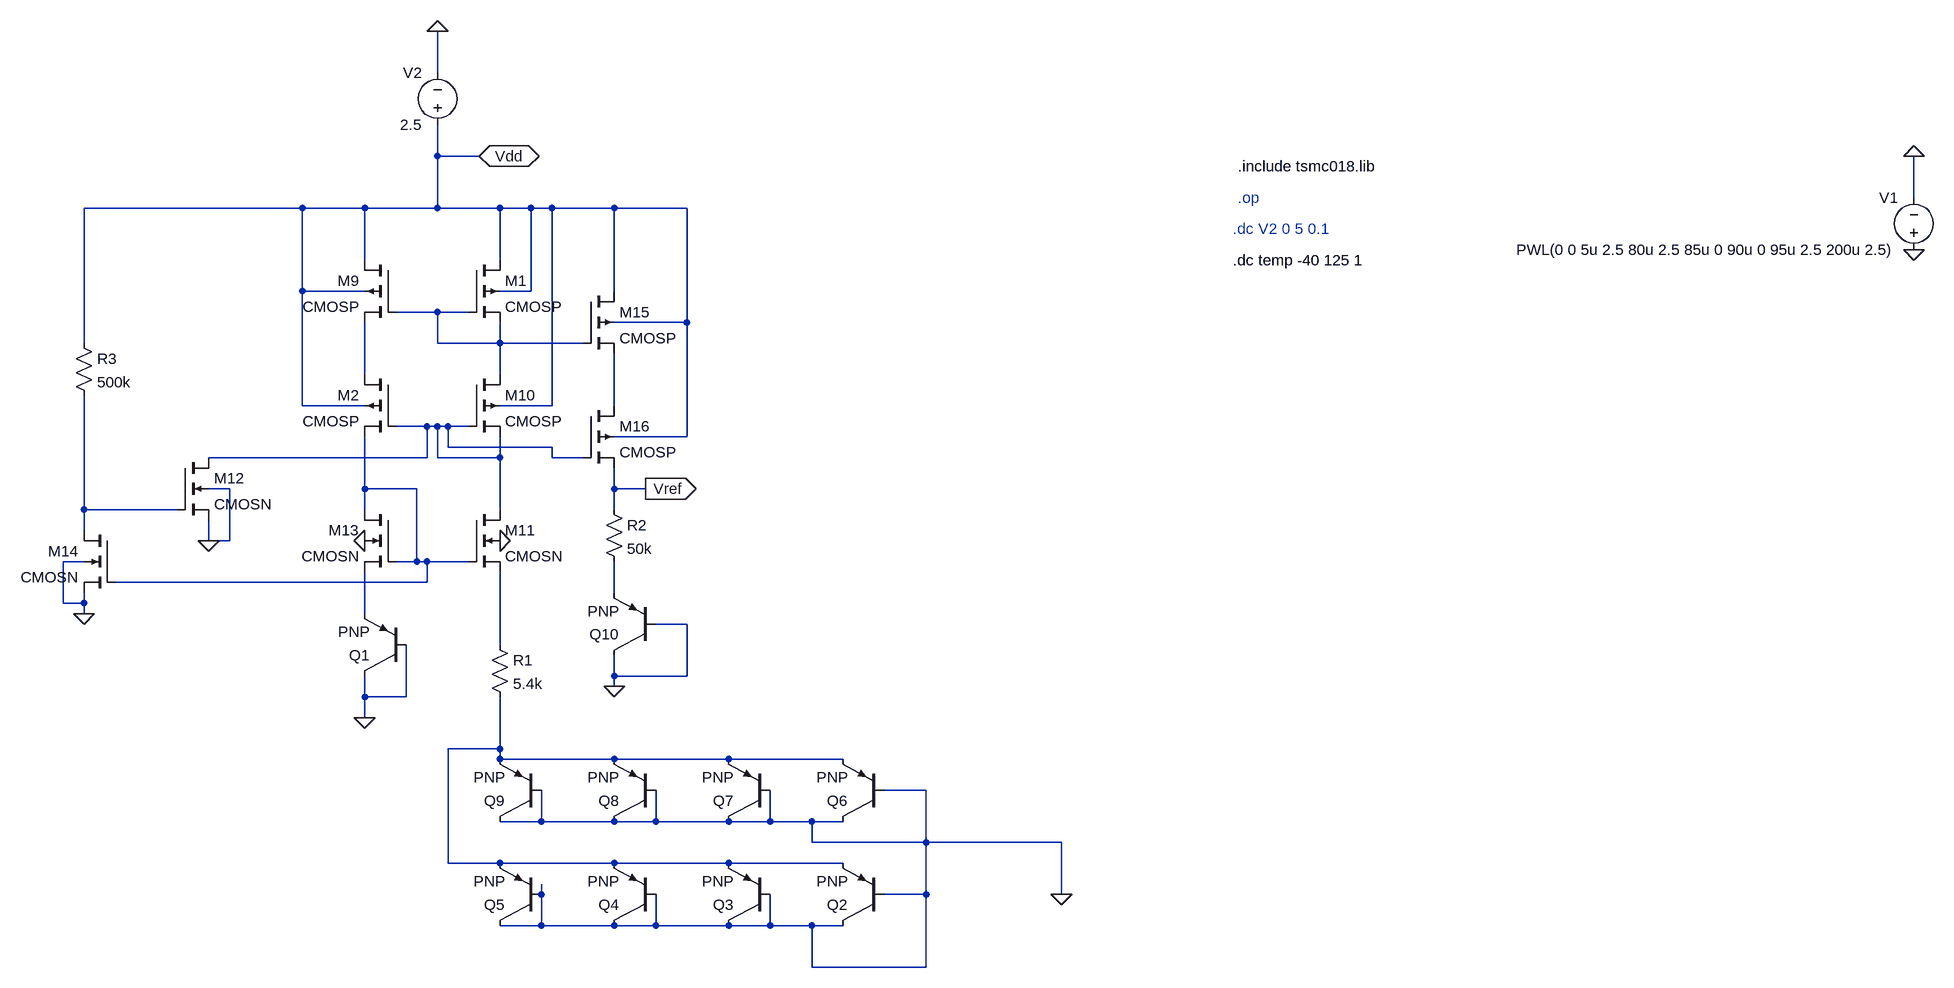
[diagram p0: schematic bgr_start_up.asc]
bgr_start_up.asc, the LTspice schematic file:
Version 4.1
SHEET 1 2292 692
WIRE -224 -2016 -224 -2080
WIRE -224 -1888 -224 -1936
WIRE -160 -1888 -224 -1888
WIRE 2048 -1824 2048 -1888
WIRE -432 -1808 -768 -1808
WIRE -336 -1808 -432 -1808
WIRE -224 -1808 -224 -1888
WIRE -224 -1808 -336 -1808
WIRE -128 -1808 -224 -1808
WIRE -80 -1808 -128 -1808
WIRE -48 -1808 -80 -1808
WIRE 48 -1808 -48 -1808
WIRE 160 -1808 48 -1808
WIRE -336 -1728 -336 -1808
WIRE -128 -1728 -128 -1808
WIRE -432 -1680 -432 -1808
WIRE -336 -1680 -432 -1680
WIRE -80 -1680 -80 -1808
WIRE -80 -1680 -128 -1680
WIRE 48 -1680 48 -1808
WIRE -224 -1648 -288 -1648
WIRE -176 -1648 -224 -1648
WIRE 160 -1632 160 -1808
WIRE 160 -1632 48 -1632
WIRE -768 -1600 -768 -1808
WIRE -224 -1600 -224 -1648
WIRE -128 -1600 -128 -1632
WIRE -128 -1600 -224 -1600
WIRE 0 -1600 -128 -1600
WIRE -336 -1552 -336 -1632
WIRE -128 -1552 -128 -1600
WIRE -432 -1504 -432 -1680
WIRE -336 -1504 -432 -1504
WIRE -48 -1504 -48 -1808
WIRE -48 -1504 -128 -1504
WIRE 48 -1504 48 -1584
WIRE -240 -1472 -288 -1472
WIRE -224 -1472 -240 -1472
WIRE -208 -1472 -224 -1472
WIRE -176 -1472 -208 -1472
WIRE 160 -1456 160 -1632
WIRE 160 -1456 48 -1456
WIRE -208 -1440 -208 -1472
WIRE -48 -1440 -208 -1440
WIRE -240 -1424 -240 -1472
WIRE -240 -1424 -576 -1424
WIRE -224 -1424 -224 -1472
WIRE -128 -1424 -128 -1456
WIRE -128 -1424 -224 -1424
WIRE -48 -1424 -48 -1440
WIRE 0 -1424 -48 -1424
WIRE -544 -1376 -576 -1376
WIRE -336 -1376 -336 -1456
WIRE -256 -1376 -336 -1376
WIRE 48 -1376 48 -1408
WIRE 96 -1376 48 -1376
WIRE -768 -1344 -768 -1520
WIRE -624 -1344 -768 -1344
WIRE -336 -1344 -336 -1376
WIRE -128 -1344 -128 -1424
WIRE 48 -1344 48 -1376
WIRE -768 -1312 -768 -1344
WIRE -576 -1296 -576 -1328
WIRE -544 -1296 -544 -1376
WIRE -544 -1296 -576 -1296
WIRE -768 -1264 -800 -1264
WIRE -256 -1264 -256 -1376
WIRE -256 -1264 -288 -1264
WIRE -240 -1264 -256 -1264
WIRE -176 -1264 -240 -1264
WIRE -240 -1232 -240 -1264
WIRE -240 -1232 -720 -1232
WIRE 48 -1216 48 -1264
WIRE -800 -1200 -800 -1264
WIRE -768 -1200 -768 -1216
WIRE -768 -1200 -800 -1200
WIRE -768 -1184 -768 -1200
WIRE -336 -1184 -336 -1248
WIRE 160 -1168 112 -1168
WIRE -128 -1136 -128 -1248
WIRE 48 -1088 48 -1120
WIRE 160 -1088 160 -1168
WIRE 160 -1088 48 -1088
WIRE 48 -1072 48 -1088
WIRE -336 -1056 -336 -1088
WIRE -272 -1056 -272 -1136
WIRE -272 -1056 -336 -1056
WIRE -336 -1024 -336 -1056
WIRE -128 -976 -128 -1056
WIRE -128 -976 -208 -976
WIRE -128 -960 -128 -976
WIRE 48 -960 -128 -960
WIRE 224 -960 48 -960
WIRE 400 -960 224 -960
WIRE 528 -912 464 -912
WIRE -64 -864 -64 -912
WIRE -64 -864 -128 -864
WIRE 48 -864 -64 -864
WIRE 112 -864 112 -912
WIRE 112 -864 48 -864
WIRE 224 -864 112 -864
WIRE 288 -864 288 -912
WIRE 288 -864 224 -864
WIRE 352 -864 288 -864
WIRE 400 -864 352 -864
WIRE 352 -832 352 -864
WIRE 528 -832 528 -912
WIRE 528 -832 352 -832
WIRE 736 -832 528 -832
WIRE -208 -800 -208 -976
WIRE -128 -800 -208 -800
WIRE 48 -800 -128 -800
WIRE 224 -800 48 -800
WIRE 400 -800 224 -800
WIRE -64 -752 -64 -768
WIRE 528 -752 528 -832
WIRE 528 -752 464 -752
WIRE 736 -752 736 -832
WIRE -64 -704 -64 -752
WIRE -64 -704 -128 -704
WIRE 48 -704 -64 -704
WIRE 112 -704 112 -752
WIRE 112 -704 48 -704
WIRE 224 -704 112 -704
WIRE 288 -704 288 -752
WIRE 288 -704 224 -704
WIRE 352 -704 288 -704
WIRE 400 -704 352 -704
WIRE 352 -640 352 -704
WIRE 528 -640 528 -752
WIRE 528 -640 352 -640
FLAG 736 -752 0
FLAG -336 -1024 0
FLAG -336 -1296 0
FLAG -128 -1296 0
FLAG 2048 -1888 0
FLAG 48 -1072 0
FLAG 96 -1376 Vref
IOPIN 96 -1376 Out
FLAG -576 -1296 0
FLAG 2048 -1744 0
FLAG -224 -2080 0
FLAG -768 -1184 0
FLAG -160 -1888 Vdd
IOPIN -160 -1888 BiDir
SYMBOL pnp -272 -1088 R180
SYMATTR InstName Q1
SYMBOL pnp 464 -704 R180
SYMATTR InstName Q2
SYMBOL pnp 288 -704 R180
SYMATTR InstName Q3
SYMBOL pnp 112 -704 R180
SYMATTR InstName Q4
SYMBOL pnp -64 -704 R180
SYMATTR InstName Q5
SYMBOL pnp 464 -864 R180
SYMATTR InstName Q6
SYMBOL pnp 288 -864 R180
SYMATTR InstName Q7
SYMBOL pnp 112 -864 R180
SYMATTR InstName Q8
SYMBOL pnp -64 -864 R180
SYMATTR InstName Q9
SYMBOL res -144 -1152 R0
SYMATTR InstName R1
SYMATTR Value 5.4k
SYMBOL voltage 2048 -1728 R180
WINDOW 0 24 96 Left 2
WINDOW 3 24 16 Left 2
WINDOW 123 0 0 Left 0
WINDOW 39 0 0 Left 0
SYMATTR InstName V1
SYMATTR Value PWL(0 0 5u 2.5 80u 2.5 85u 0 90u 0 95u 2.5 200u 2.5)
SYMBOL res 32 -1360 R0
SYMATTR InstName R2
SYMATTR Value 50k
SYMBOL pnp 112 -1120 R180
SYMATTR InstName Q10
SYMBOL res -784 -1616 R0
SYMATTR InstName R3
SYMATTR Value 500k
SYMBOL voltage -224 -1920 R180
WINDOW 0 24 96 Left 2
WINDOW 3 24 16 Left 2
WINDOW 123 0 0 Left 0
WINDOW 39 0 0 Left 0
SYMATTR InstName V2
SYMATTR Value 2.5
SYMBOL cmosn -176 -1344 R0
SYMATTR InstName M11
SYMATTR Value2 l=4u w=20u
SYMBOL cmosn -624 -1424 R0
SYMATTR InstName M12
SYMATTR Value2 l=1u w=20u
SYMBOL cmosn -288 -1344 M0
SYMATTR InstName M13
SYMATTR Value2 l=4u w=20u
SYMBOL cmosn -720 -1312 M0
SYMATTR InstName M14
SYMATTR Value2 l=1u w=20u
SYMBOL cmosp -176 -1728 R0
SYMATTR InstName M1
SYMATTR Value2 l=1u w=80u
SYMBOL cmosp -288 -1552 M0
SYMATTR InstName M2
SYMATTR Value2 l=2u w=50u
SYMBOL cmosp -288 -1728 M0
SYMATTR InstName M9
SYMATTR Value2 l=1u w=80u
SYMBOL cmosp -176 -1552 R0
SYMATTR InstName M10
SYMATTR Value2 l=2u w=50u
SYMBOL cmosp 0 -1680 R0
SYMATTR InstName M15
SYMATTR Value2 l=1u w=80u
SYMBOL cmosp 0 -1504 R0
SYMATTR InstName M16
SYMATTR Value2 l=2u w=50u
TEXT 1000 -1728 Left 2 !.dc temp -40 125 1
TEXT 1000 -1776 Left 2 ;.dc V2 0 5 0.1
TEXT 1008 -1824 Left 2 ;.op
TEXT 1008 -1872 Left 2 !.include tsmc018.lib

The netlist it stands for:
* bgr_start_up.asc
Q1 0 0 N008 0 PNP
Q2 0 0 N010 0 PNP
Q3 0 0 N010 0 PNP
Q4 0 0 N010 0 PNP
Q5 0 0 N010 0 PNP
Q6 0 0 N010 0 PNP
Q7 0 0 N010 0 PNP
Q8 0 0 N010 0 PNP
Q9 0 0 N010 0 PNP
R1 N009 N010 5.4k
V1 0 0 PWL(0 0 5u 2.5 80u 2.5 85u 0 90u 0 95u 2.5 200u 2.5)
R2 Vref N007 50k
Q10 0 0 N007 0 PNP
R3 Vdd N006 500k
V2 Vdd 0 2.5
M11 N004 N005 N009 0 CMOSN l=4u w=20u
M12 N004 N006 0 0 CMOSN l=1u w=20u
M13 N005 N005 N008 0 CMOSN l=4u w=20u
M14 N006 N005 0 0 CMOSN l=1u w=20u
M1 Vdd N001 N001 Vdd CMOSP l=1u w=80u
M2 N002 N004 N005 Vdd CMOSP l=2u w=50u
M9 Vdd N001 N002 Vdd CMOSP l=1u w=80u
M10 N001 N004 N004 Vdd CMOSP l=2u w=50u
M15 Vdd N001 N003 Vdd CMOSP l=1u w=80u
M16 N003 N004 Vref Vdd CMOSP l=2u w=50u
.model NPN NPN
.model PNP PNP
.lib standard.bjt
.model NMOS NMOS
.model PMOS PMOS
.lib standard.mos
.dc temp -40 125 1
* .dc V2 0 5 0.1
* .op
.include tsmc018.lib
.backanno
.end